# EasyEDA Pro project MSB.eprj

# Schematic Schematic1
Create Date: 2022-10-09; Page Name: P1; Project Name: MSB; Schematic Name: Schematic1; Update Date: 2022-10-13; Company: 电子科技大学; Drawed: HelloworldGu; Page Size: A4; Reviewed: HelloworldGu; Version: V1.0
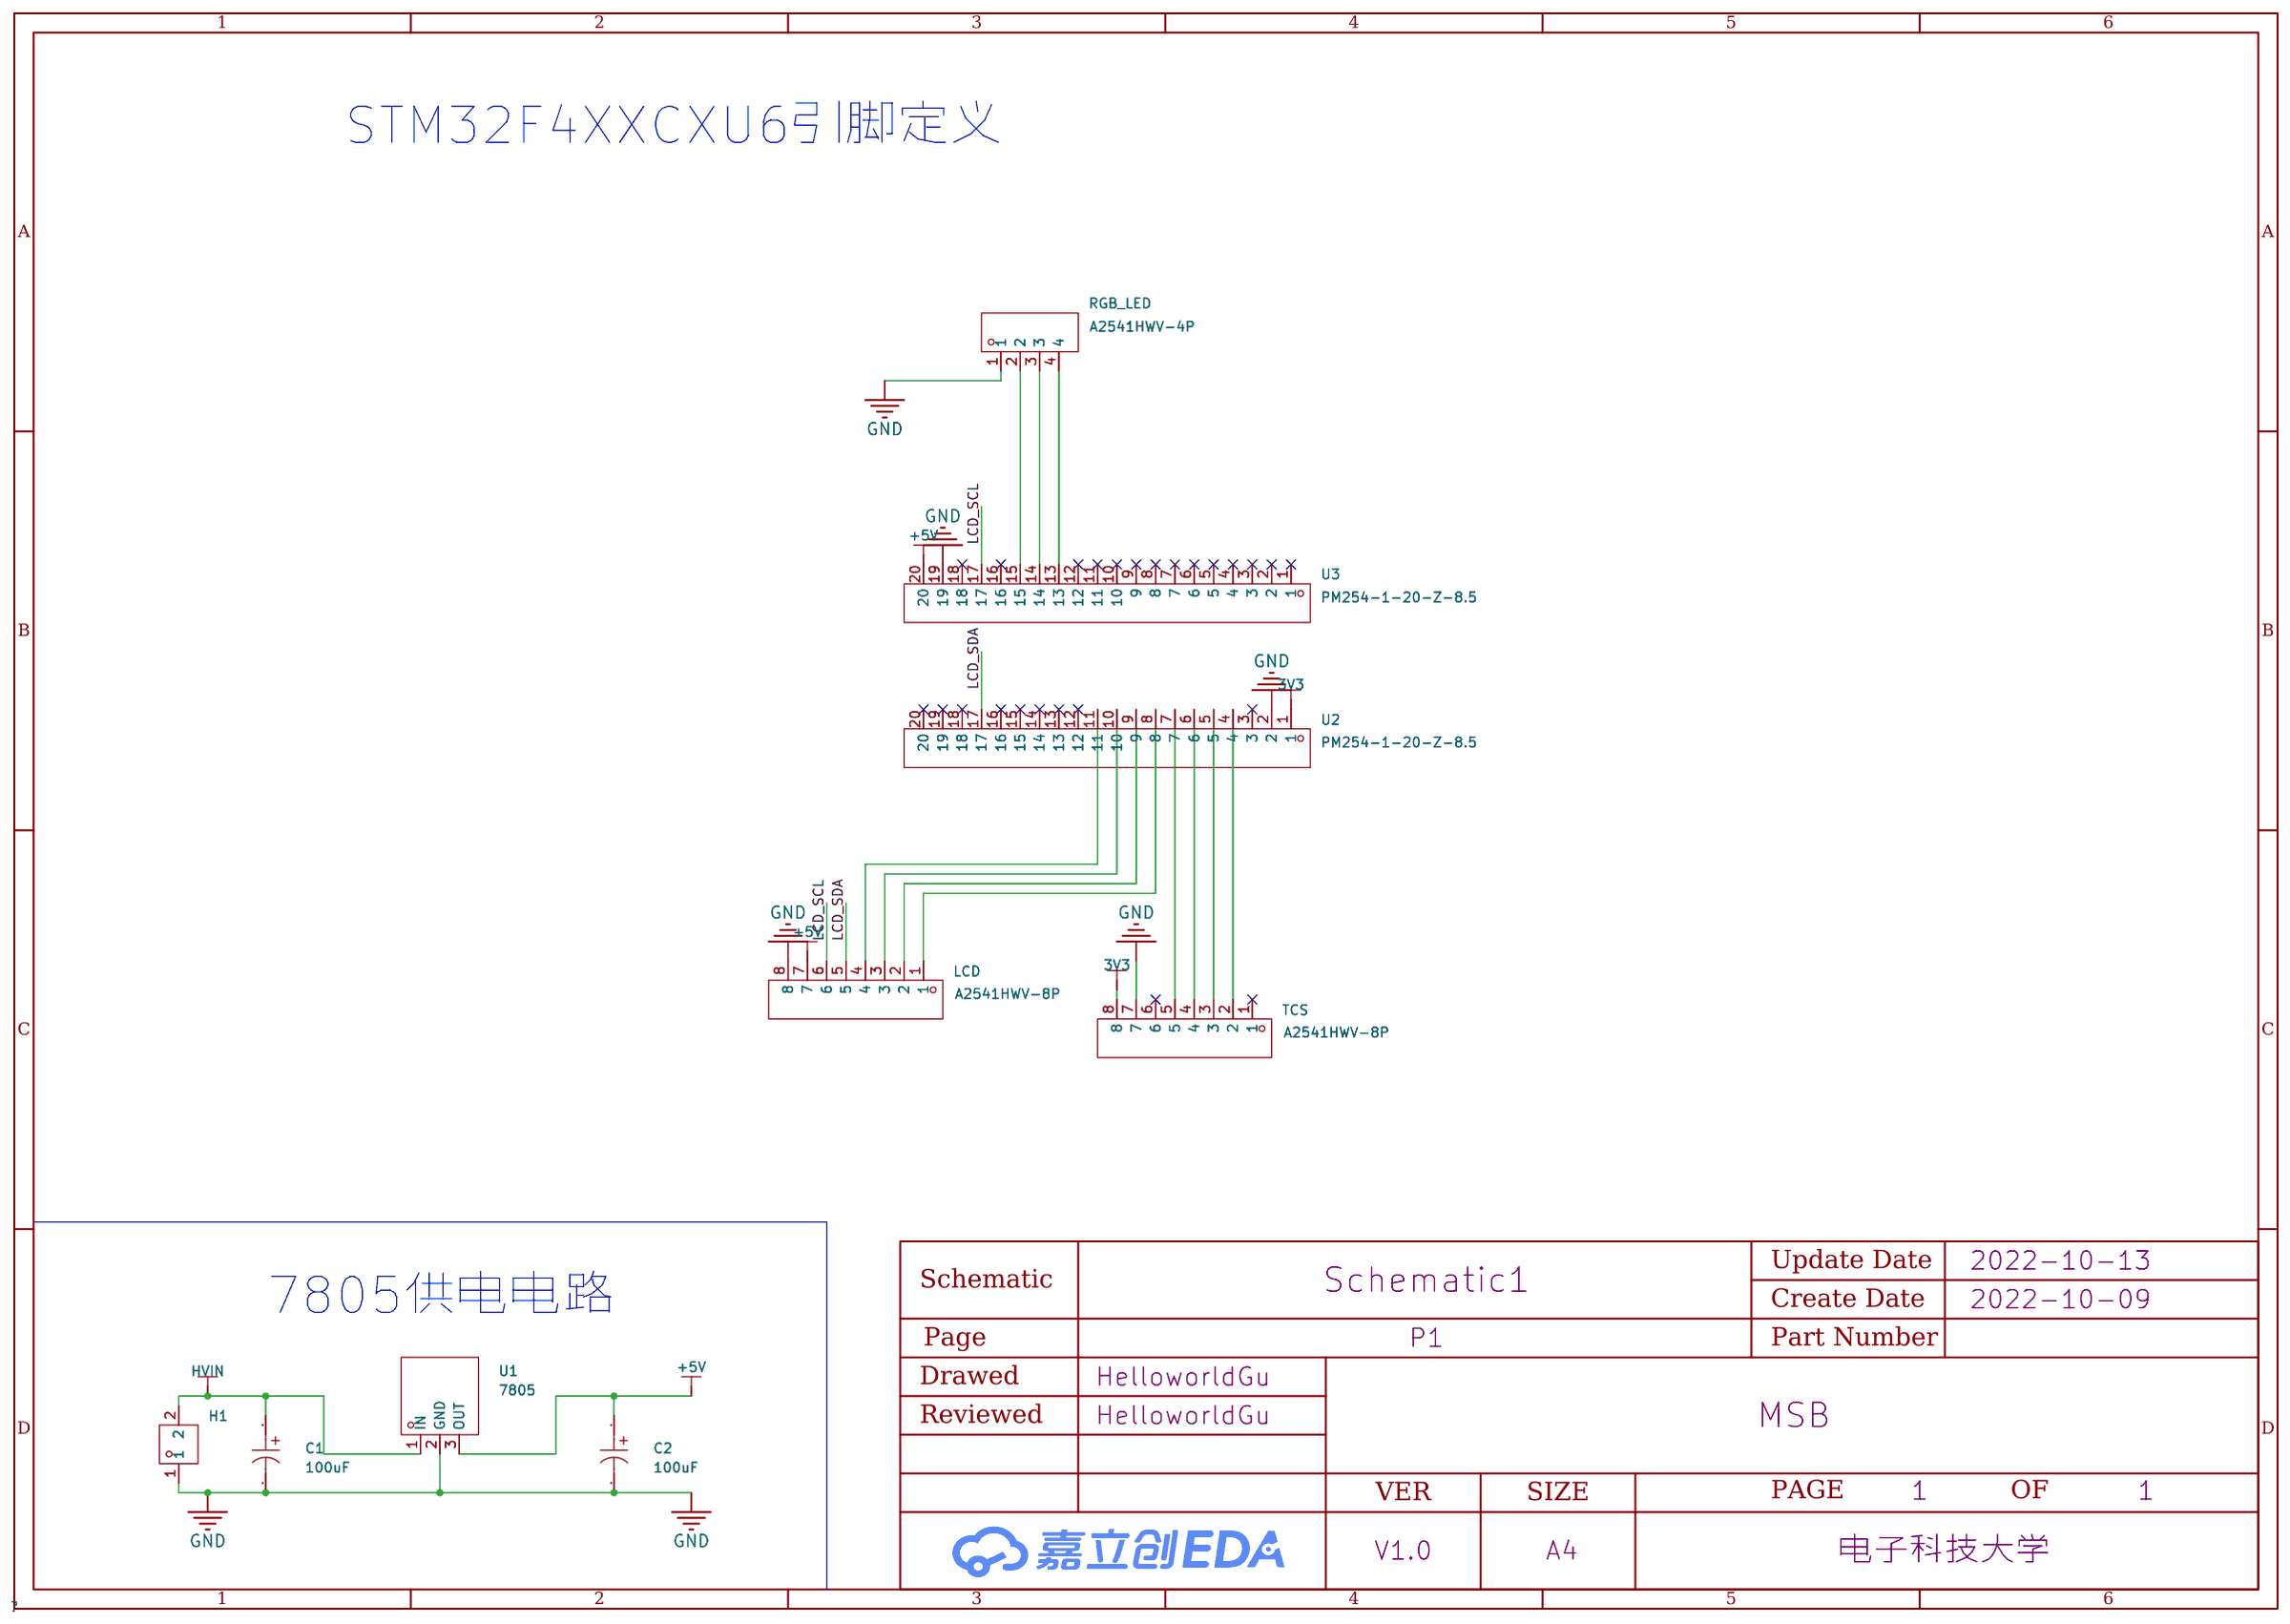
[diagram p0: schematic sheet]

## Parts
C1  100uF  [CAP-TH_BD6.3-P2.50-D0.5-FD]
C2  100uF  [CAP-TH_BD6.3-P2.50-D0.5-FD]
H1  X6521WV-2x01H-C30D60  [HDR-TH_2P-P2.54-V-M]
LCD  A2541HWV-8P  [HDR-TH_8P-P2.54-V-F]
RGB_LED  A2541HWV-4P  [HDR-TH_4P-P2.54-V-F]
TCS  A2541HWV-8P  [HDR-TH_8P-P2.54-V-F]
U1  7805  [TO-220-3_L10.2-W4.5-P2.54-L-1]
U2  PM254-1-20-Z-8.5  [HDR-TH_20P-P2.54-V-F-2]
U3  PM254-1-20-Z-8.5  [HDR-TH_20P-P2.54-V-F-2]

## Library data of the parts
C1 C2 = ECF1VM101E12OTPO: 容值:100uF;精度:±20%;额定电压:35V;电容体直径:-;电容体长度:-;脚间距:-;纹波电流:-;等效串联电阻:-;工作寿命:-;; LCSC Part Name: 100uF ±20% 35V; Supplier Part: C783438; Manufacturer: Yunxing(云星); Supplier Footprint: 直插,D6.3xL12mm; Datasheet: https://atta.szlcsc.com/upload/public/pdf/source/20200506/C525419_5DB4C0F9B5E6E2AFEBB1800A1F09D9CB.pdf; Supplier: LCSC; Tolerance: ±20%; Rated Voltage: 35V
H1 = X6521WV-2x01H-C30D60: 间距:2.54mm;总PIN位数:2;排数:2;插针结构:2x1P;行距:2.54mm;安装类型:直插;圆针/方针:方针;额定电流:3A;额定电压:250V;配合针长度:6mm;塑高:2.5mm;端接针长度:3mm;触头材质:黄铜;触头镀层:金;工作温度范围:-40~+105;焊接温度(最大值):260;颜色:黑色;; LCSC Part Name: 2.54mm 2x1P 直插 方针; Supplier Part: C2883961; Manufacturer: XKB Connectivity(中国星坤); Supplier Footprint: 直插,P=2.54mm; JLCPCB Part Class: 扩展库; Datasheet: https://atta.szlcsc.com/upload/public/pdf/source/20211009/DE33EBA4104B5B447A7BD8383FBBA145.pdf; Supplier: LCSC; Pitch: 2.54mm; Number of Pins: 2; Number of Rows: 2; Pin Structure: 2x1P; Row Spacing: 2.54mm; Mounting Type: 直插; Circluar Pins/Square Pins: 方针; Current Rating (Max): 3A; Voltage Rating (Max): 250V; Length of Mating Pin: 6mm; Insulation Height: 2.5mm; Length of End Connection Pin: 3mm; Contact Material: 黄铜; Contact Plating: 金; Operating Temperature Range: -40~+105; Welding Temperature (Max): 260; Color: 黑色
LCD TCS = A2541HWV-8P_1: Supplier Part: C5149225; Manufacturer: CJT(长江连接器); Supplier Footprint: 直插,P=2.54mm; Datasheet: https://atta.szlcsc.com/upload/public/pdf/source/20220627/2C2B052110018A668F9E94322E3656DC.pdf; Supplier: LCSC
RGB_LED = A2541HWV-4P_2: Supplier Part: C5176037; Manufacturer: CJT(长江连接器); Supplier Footprint: 直插,P=2.54mm; Datasheet: https://atta.szlcsc.com/upload/public/pdf/source/20220916/7A4096DE70FDAC144DF90D6CBDE9C2A1.pdf; Supplier: LCSC
U1 = 7805: Supplier Part: C4944936; Manufacturer: SY(顺烨）; Supplier Footprint: TO-220AB; Datasheet: https://atta.szlcsc.com/upload/public/pdf/source/20220719/323A3F14557C229271C454C7C0F759A5.pdf; Supplier: LCSC
U2 U3 = PM254-1-20-Z-8.5: 间距:2.54mm;总孔位数:20;排数:1;插孔结构:1x20P;行距:-;安装类型:直插;圆孔/方孔:方孔;额定电流:3A;额定电压:-;插孔方向:顶部;塑高:8.5mm;工作温度范围:-40~+105;; LCSC Part Name: 2.54mm 1x20P; Supplier Part: C2897383; Manufacturer: HCTL(华灿天禄); Supplier Footprint: 直插,P=2.54mm; JLCPCB Part Class: 扩展库; Datasheet: https://atta.szlcsc.com/upload/public/pdf/source/20210927/A587EC018F0ED68DBE3C69C90D2D513F.pdf; Supplier: LCSC; Pitch: 2.54mm; Number of Holes: 20; Number of Rows: 1; Holes Structure: 1x20P; Mounting Type: 直插; Circular Hole / Square Hole: 方孔; Current Rating (Max): 3A; Holes Direction: 顶部; Insulation Height: 8.5mm; Operating Temperature Range: -40~+105

## Nets
3V3: TCS.8 U2.1
+5V: C2.1 LCD.7 U1.3(OUT) U3.20
GND: C1.2 C2.2 H1.1 LCD.8 RGB_LED.1 TCS.7 U1.2(GND) U2.2 U3.19
HVIN: C1.1 H1.2 U1.1(IN)
LCD_SCL: LCD.6 U3.17
LCD_SDA: LCD.5 U2.17
Net-(LCD-1): LCD.1 U2.8
Net-(LCD-2): LCD.2 U2.9
Net-(LCD-3): LCD.3 U2.10
Net-(LCD-4): LCD.4 U2.11
Net-(RGB_LED-2): RGB_LED.2 U3.15
Net-(RGB_LED-3): RGB_LED.3 U3.14
Net-(RGB_LED-4): RGB_LED.4 U3.13
Net-(TCS-2): TCS.2 U2.4
Net-(TCS-3): TCS.3 U2.5
Net-(TCS-4): TCS.4 U2.6
Net-(TCS-5): TCS.5 U2.7

Not connected (* = marked no-connect by the designer): TCS 1* 6*; U2 3* 12* 13* 14* 15* 16* 18* 19* 20*; U3 1* 2* 3* 4* 5* 6* 7* 8* 9* 10* 11* 12* 16* 18*

## Notes on the sheet
- STM32F4XXCXU6引脚定义
- 7805供电电路

# Board PCB1
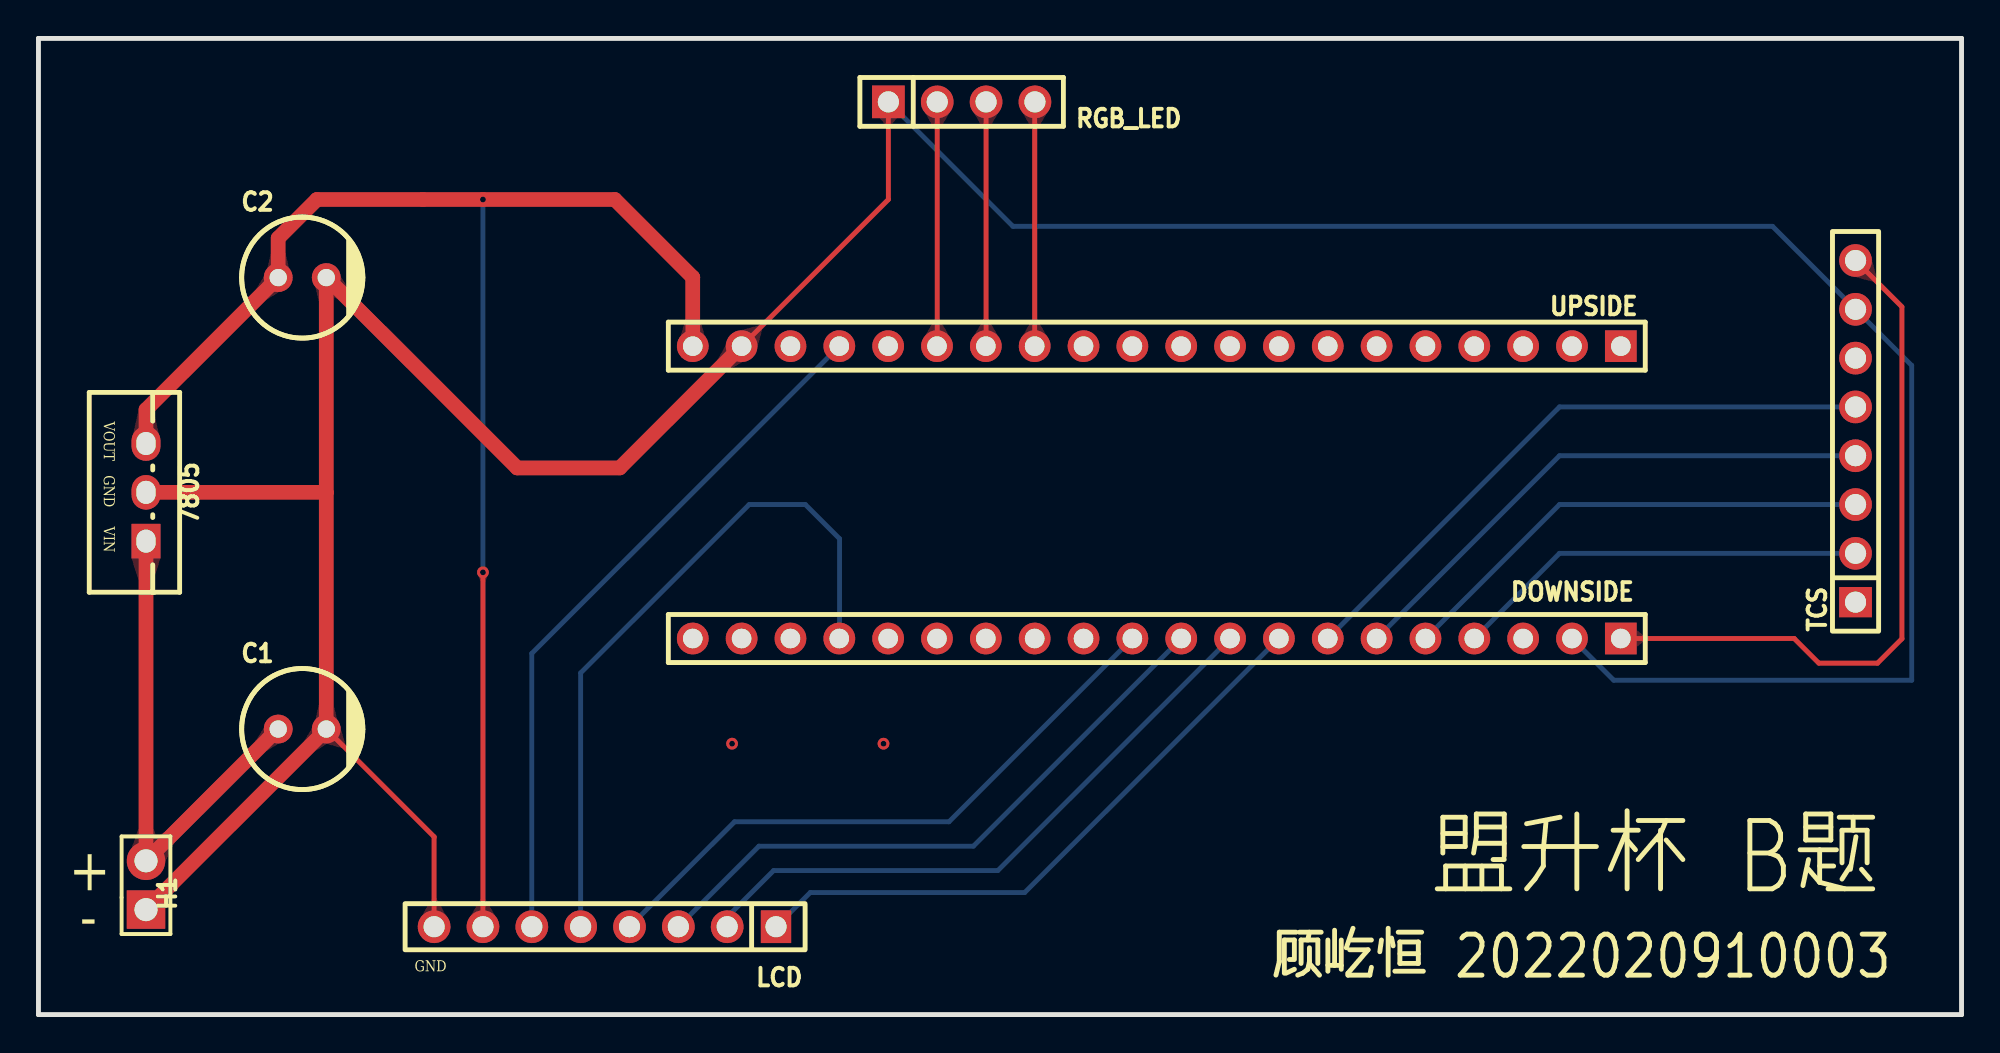
[diagram p1: board, top side]
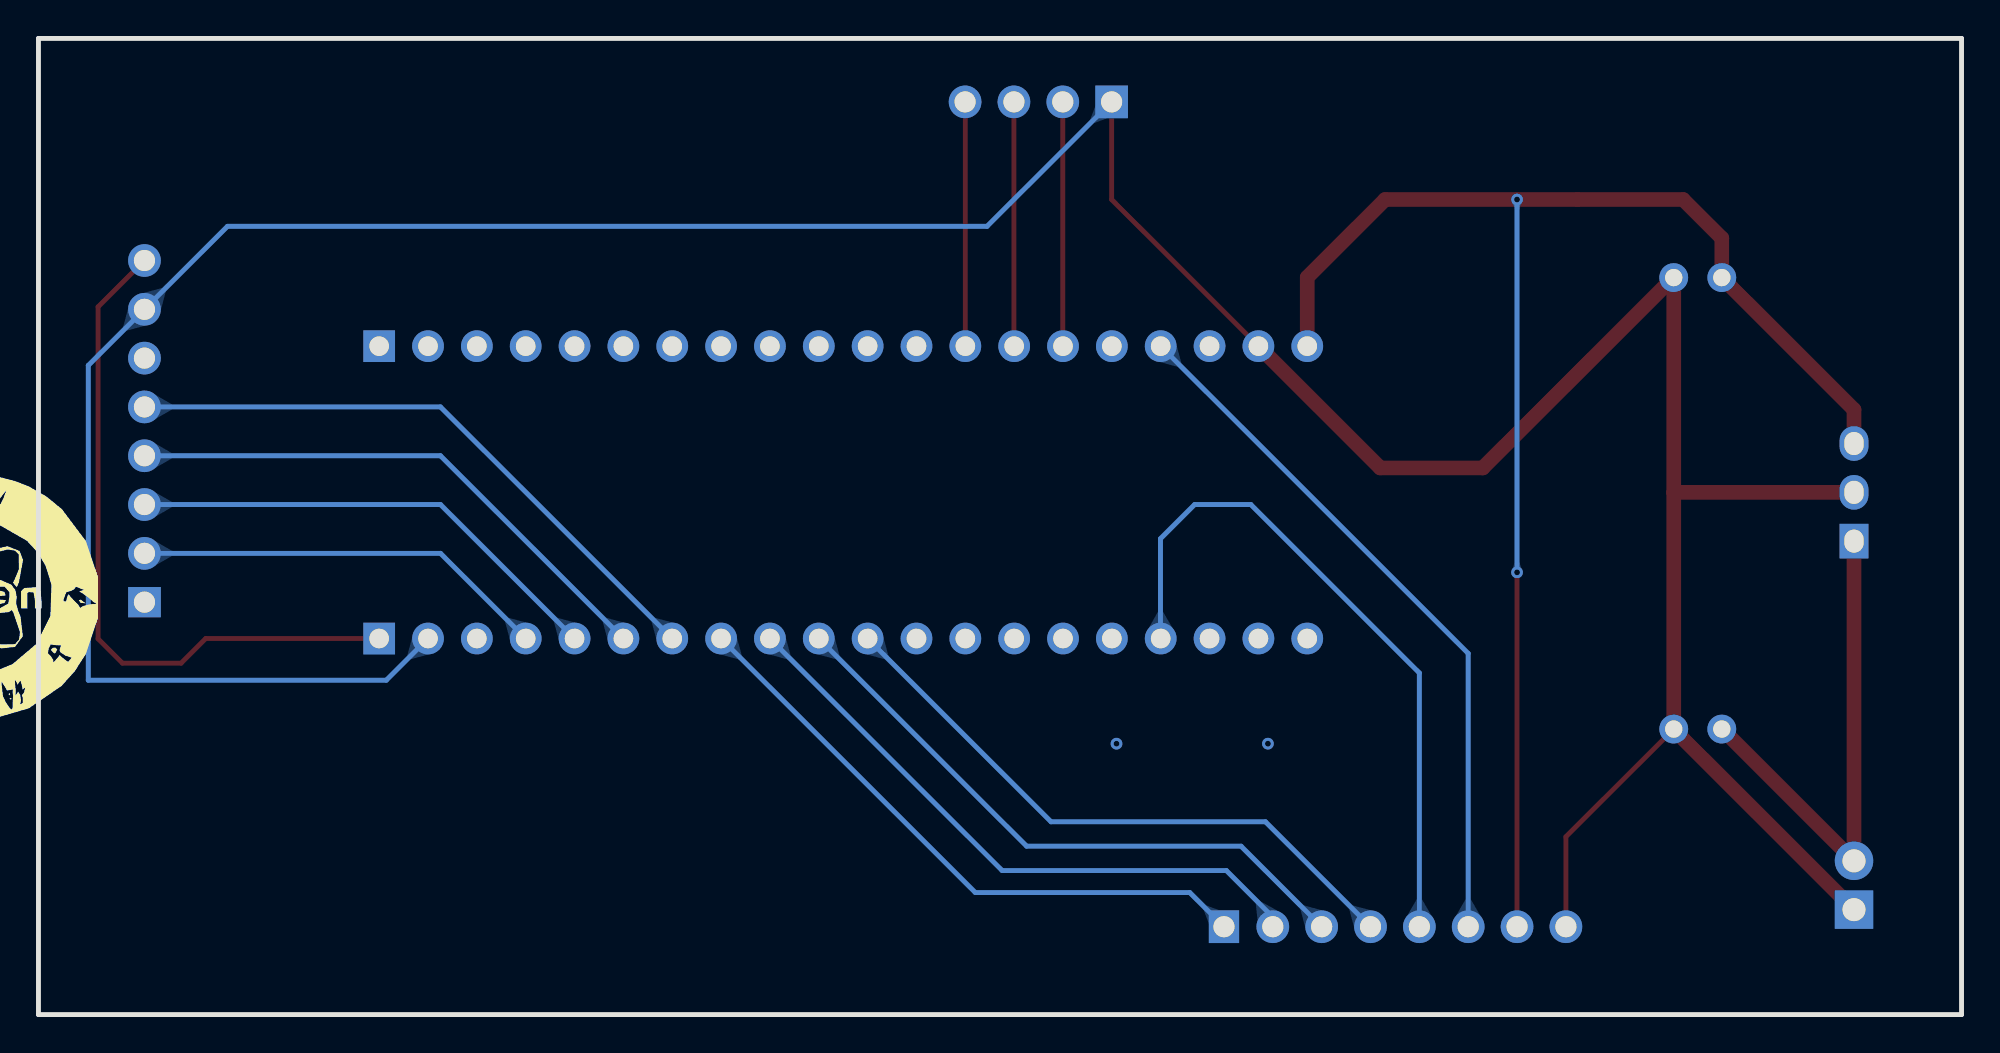
[diagram p2: board, bottom side, seen from below]

Outline 100 x 50.8 mm; copper layers: Top Layer, Bottom Layer. Coordinates in mm from the lower left corner of the outline.
Outline path: 0,50.8 0,0 arc(0,0) 0,0 100,0 arc(100,0) 100,0 100,50.8 arc(100,50.8) 100,50.8 0,50.8 arc(0,50.8) 0,50.8
Stack: Top Layer 0.035mm / Dielectric1 1.51mm FR4 er 4.5 / Bottom Layer 0.035mm

## Design rules (mm)
spacing safeClearance (default): track to track 0.203, other pairs 0.203 to 0.203
track width trackWidth (default): min 0.254, default 0.254, max 0.762
track width VCC and GND: min 0.254, default 0.762, max 0.762
differential pair differentialPair (default): width min 0.127, default 0.254, max 2.54; gap min 0.152, default 0.152
via viaSize (default): diameter min 0.5, default 0.61, max 10; hole min 0.3, default 0.305, max 5.999
net HVIN uses VCC and GND
net +5V uses VCC and GND
net GND uses VCC and GND
net 3V3 uses VCC and GND

## Placement (name value [footprint] x y rotation side)
7805  7805  [TO-220-3_L10.2-W4.5-P2.54-L-1]  5.59 27.18 90 top
C1  100uF  [CAP-TH_BD6.3-P2.50-D0.5-FD]  13.72 14.86 0 top
C2  100uF  [CAP-TH_BD6.3-P2.50-D0.5-FD]  13.72 38.35 0 top
DOWNSIDE  PM254-1-20-Z-8.5  [HDR-TH_20P-P2.54-V-F-2]  58.15 19.57 180 top
H1  X6521WV-2x01H-C30D60  [HDR-TH_2P-P2.54-V-M]  5.59 6.73 90 top
LCD  A2541HWV-8P  [HDR-TH_8P-P2.54-V-F]  29.46 4.57 180 top
RGB_LED  A2541HWV-4P  [HDR-TH_4P-P2.54-V-F]  48.01 47.5 0 top
TCS  A2541HWV-8P  [HDR-TH_8P-P2.54-V-F]  94.49 30.35 90 top
UPSIDE  PM254-1-20-Z-8.5  [HDR-TH_20P-P2.54-V-F-2]  58.15 34.79 180 top

## Footprints (pads in the part's own frame, mm; a bottom-side part is the same pattern mirrored in y, then rotated)
CAP-TH_BD6.3-P2.50-D0.5-FD
  round 1.5 hole 0.9: 1(-1.25,0) 2(1.25,0)
HDR-TH_2P-P2.54-V-M
  rect 2x2 hole 1.2: 1(-1.27,0)
  round 2 hole 1.2: 2(1.27,0)
HDR-TH_4P-P2.54-V-F
  rect 1.7x1.7 hole 1.1: 1(-3.81,0)
  round 1.7 hole 1.1: 2(-1.27,0) 3(1.27,0) 4(3.81,0)
HDR-TH_8P-P2.54-V-F
  rect 1.575x1.7 hole 1.1: 1(-8.89,0)
  round 1.7 hole 1.1: 2(-6.35,0) 3(-3.81,0) 4(-1.27,0) 5(1.27,0) 6(3.81,0) 7(6.35,0) 8(8.89,0)
HDR-TH_20P-P2.54-V-F-2
  rect 1.65x1.65 hole 1.02: 1(-24.13,0)
  round 1.65 hole 1.02: 2(-21.59,0) 3(-19.05,0) 4(-16.51,0) 5(-13.97,0) 6(-11.43,0) 7(-8.89,0) 8(-6.35,0) 9(-3.81,0) 10(-1.27,0) 11(1.27,0) 12(3.81,0) 13(6.35,0) 14(8.89,0) 15(11.43,0) 16(13.97,0) 17(16.51,0) 18(19.05,0) 19(21.59,0) 20(24.13,0)
TO-220-3_L10.2-W4.5-P2.54-L-1
  rect 1.8x1.5 hole 1.2x1: 1(-2.54,0)
  oval 1.8x1.5 hole 1.2x1: 2(0,0) 3(2.54,0)

## Nets
3V3: DOWNSIDE.1 TCS.8
+5V: 7805.3 C2.1 LCD.7 UPSIDE.20
GND: 7805.2 C1.2 C2.2 DOWNSIDE.2 H1.1 LCD.8 RGB_LED.1 TCS.7 UPSIDE.19
HVIN: 7805.1 C1.1 H1.2
LCD_SCL: LCD.6 UPSIDE.17
LCD_SDA: DOWNSIDE.17 LCD.5
$1N3245: DOWNSIDE.4 TCS.2
$1N3264: DOWNSIDE.5 TCS.3
$1N3277: DOWNSIDE.6 TCS.4
$1N3296: DOWNSIDE.7 TCS.5
$1N3309: DOWNSIDE.8 LCD.1
$1N3322: DOWNSIDE.9 LCD.2
$1N3341: DOWNSIDE.10 LCD.3
$1N3360: DOWNSIDE.11 LCD.4
$1N3524: RGB_LED.4 UPSIDE.13
$1N3539: RGB_LED.3 UPSIDE.14
$1N3554: RGB_LED.2 UPSIDE.15

Pads without a net: DOWNSIDE 3 12 13 14 15 16 18 19 20; TCS 1 6; UPSIDE 1 2 3 4 5 6 7 8 9 10 11 12 16 18

## Via types
v1: diameter 0.61, hole 0.305, Top Layer to Bottom Layer, 4 vias

## Routing (per net, layer and track width the routed paths; a pad name or vN(x,y) marks a point on that pad's centre or on a via; arc(x,y) is an arc through that point)
3V3: length 36.4
  Top Layer w0.254: TCS.8 96.9,36.83 96.9,19.56 95.63,18.29 92.58,18.29 91.3,19.57 DOWNSIDE.1
+5V: length 79
  Top Layer w0.254: v1(23.11,23.01) LCD.7
  Top Layer w0.762: 7805.3 5.59,31.48 C2.1 12.47,40.41 14.48,42.42 v1(23.11,42.42) 29.97,42.42 34.02,38.37 UPSIDE.20
  Bottom Layer w0.254: v1(23.11,42.42) v1(23.11,23.01)
GND: length 196.8
  Top Layer w0.254: LCD.8 20.57,9.25 C1.2 ; RGB_LED.1 44.2,42.42 UPSIDE.19
  Top Layer w0.762: UPSIDE.19 30.23,28.45 24.89,28.45 14.99,38.35 C2.2 14.97,27.17 ; 14.97,27.17 14.96,27.18 7805.2 ; 14.97,27.17 C1.2 ; H1.1 14.97,14.84
  Bottom Layer w0.254: DOWNSIDE.2 81.91,17.4 97.41,17.4 97.41,33.78 90.17,41.02 50.67,41.02 RGB_LED.1
  vias: v1(36.07,14.1) v1(43.94,14.1)
HVIN: length 26.6
  Top Layer w0.762: 7805.1 H1.2 12.47,14.88 12.47,15.11
LCD_SCL: length 36.8
  Bottom Layer w0.254: UPSIDE.17 25.65,18.8 LCD.6
LCD_SDA: length 36.2
  Bottom Layer w0.254: DOWNSIDE.17 41.66,19.58 41.66,24.77 39.88,26.54 36.96,26.54 28.19,17.78 LCD.5
$1N3245: length 21.7
  Bottom Layer w0.254: TCS.2 79.1,24 DOWNSIDE.4
$1N3264: length 25.3
  Bottom Layer w0.254: TCS.3 79.1,26.54 DOWNSIDE.5
$1N3277: length 28.8
  Bottom Layer w0.254: TCS.4 79.1,29.08 DOWNSIDE.6
$1N3296: length 32.4
  Bottom Layer w0.254: DOWNSIDE.7 79.1,31.62 TCS.5
$1N3309: length 32.4
  Bottom Layer w0.254: LCD.1 40.13,6.35 51.28,6.35 DOWNSIDE.8
$1N3322: length 32.7
  Bottom Layer w0.254: LCD.2 35.81,5.08 38.23,7.49 49.89,7.49 DOWNSIDE.9
$1N3341: length 32.4
  Bottom Layer w0.254: LCD.3 37.47,8.76 48.62,8.76 DOWNSIDE.10
$1N3360: length 32.4
  Bottom Layer w0.254: DOWNSIDE.11 47.35,10.03 36.19,10.03 LCD.4
$1N3524: length 12.7
  Top Layer w0.254: RGB_LED.4 51.8,47.49 UPSIDE.13
$1N3539: length 12.7
  Top Layer w0.254: UPSIDE.14 49.28,34.8 RGB_LED.3
$1N3554: length 12.7
  Top Layer w0.254: UPSIDE.15 46.74,34.8 RGB_LED.2

## Copper pours and planes (outline as drawn; the poured copper is in the pictures)
GND on Top Layer: -9.78,60.96 118.36,60.96 118.36,-12.95 -9.78,-12.95
GND on Bottom Layer: -4.57,57.53 107.19,57.53 107.19,-7.11 -4.57,-7.11

Small or netless copper shapes (teardrops, artwork), in the pictures only: 28 on Top Layer, 26 on Bottom Layer

## Text on the board
Top Silkscreen Layer: VOUT | GND | VIN | + | - | 顾屹恒 2022020910003 | 盟升杯 B题
